# Altium schematic sheet Top_Design.SchDoc
size A4; SheetNumber: 1; SheetTotal: 7
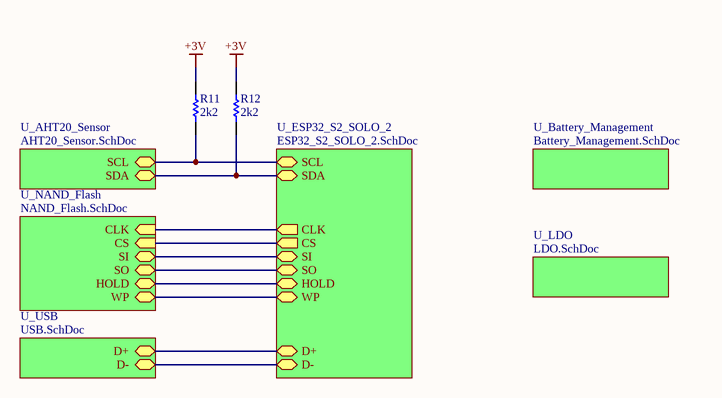
[diagram p0: Top_Design.SchDoc]

## Parts
R11  value 2k2  [Wurth 0603 Resistor]  (hidden comment: Generic Resistor 2k2 0603)
R12  value 2k2  [Wurth 0603 Resistor]  (hidden comment: Generic Resistor 2k2 0603)

## Sub-sheets
U_AHT20_Sensor = AHT20_Sensor.SchDoc: SDA (bidir), SCL (bidir)
U_Battery_Management = Battery_Management.SchDoc: no entries
U_ESP32_S2_SOLO_2 = ESP32_S2_SOLO_2.SchDoc: SCL (bidir), SDA (bidir), D- (bidir), D+ (bidir), HOLD (bidir), WP (bidir), SI (bidir), SO (bidir), CS (out), CLK (out)
U_LDO = LDO.SchDoc: no entries
U_NAND_Flash = NAND_Flash.SchDoc: SI (bidir), HOLD (bidir), SO (bidir), WP (bidir), CLK (in), CS (in)
U_USB = USB.SchDoc: D- (bidir), D+ (bidir)

## Nets
+3V: R11.2 R12.2
NetR11_1: R11.1 ; sheet U_AHT20_Sensor/SCL, sheet U_ESP32_S2_SOLO_2/SCL
NetR12_1: R12.1 ; sheet U_AHT20_Sensor/SDA, sheet U_ESP32_S2_SOLO_2/SDA
(unnamed): sheet U_ESP32_S2_SOLO_2/D-, sheet U_USB/D-
(unnamed): sheet U_ESP32_S2_SOLO_2/D+, sheet U_USB/D+
(unnamed): sheet U_ESP32_S2_SOLO_2/HOLD, sheet U_NAND_Flash/HOLD
(unnamed): sheet U_ESP32_S2_SOLO_2/WP, sheet U_NAND_Flash/WP
(unnamed): sheet U_ESP32_S2_SOLO_2/SI, sheet U_NAND_Flash/SI
(unnamed): sheet U_ESP32_S2_SOLO_2/SO, sheet U_NAND_Flash/SO
(unnamed): sheet U_ESP32_S2_SOLO_2/CS, sheet U_NAND_Flash/CS
(unnamed): sheet U_ESP32_S2_SOLO_2/CLK, sheet U_NAND_Flash/CLK